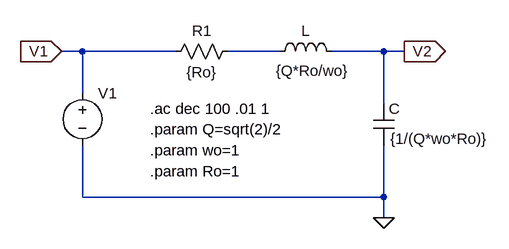
[diagram p0: schematic SOS_pasabajo_simple.asc]
SOS_pasabajo_simple.asc, the LTspice schematic file:
Version 4
SHEET 1 880 680
WIRE -224 112 -256 112
WIRE -80 112 -224 112
WIRE 80 112 0 112
WIRE 240 112 160 112
WIRE 272 112 240 112
WIRE -224 176 -224 112
WIRE 240 192 240 112
WIRE -224 336 -224 256
WIRE 240 336 240 256
WIRE 240 336 -224 336
WIRE 240 368 240 336
FLAG -256 112 V1
IOPIN -256 112 In
FLAG 272 112 V2
IOPIN 272 112 Out
FLAG 240 368 0
SYMBOL ind 64 128 R270
WINDOW 0 32 56 VTop 2
WINDOW 3 -29 66 VTop 2
SYMATTR InstName L
SYMATTR Value {Q*Ro/wo}
SYMBOL cap 224 192 R0
WINDOW 3 26 54 Left 2
SYMATTR Value {1/(Q*wo*Ro)}
SYMATTR InstName C
SYMBOL voltage -224 160 R0
WINDOW 3 24 96 Invisible 2
WINDOW 39 0 0 Left 0
SYMATTR Value SINE(0 1 0 0 0 0 1000)
SYMATTR InstName V1
SYMATTR Value2 AC 1 0
SYMBOL res 16 96 R90
WINDOW 0 0 56 VBottom 2
WINDOW 3 32 56 VTop 2
SYMATTR InstName R1
SYMATTR Value {Ro}
TEXT -120 200 Left 2 !.ac dec 100 .01 1
TEXT -120 232 Left 2 !.param Q=sqrt(2)/2
TEXT -120 264 Left 2 !.param wo=1
TEXT -120 296 Left 2 !.param Ro=1

The netlist it stands for:
* SOS_pasabajo_simple.asc
L N001 V2 {Q*Ro/wo}
C V2 0 {1/(Q*wo*Ro)}
V1 V1 0 SINE(0 1 0 0 0 0 1000) AC 1 0
R1 N001 V1 {Ro}
.ac dec 100 .01 1
.param Q=sqrt(2)/2
.param wo=1
.param Ro=1
.backanno
.end